# EasyEDA schematic SCH_555-pickaxe_2025-03-12.json
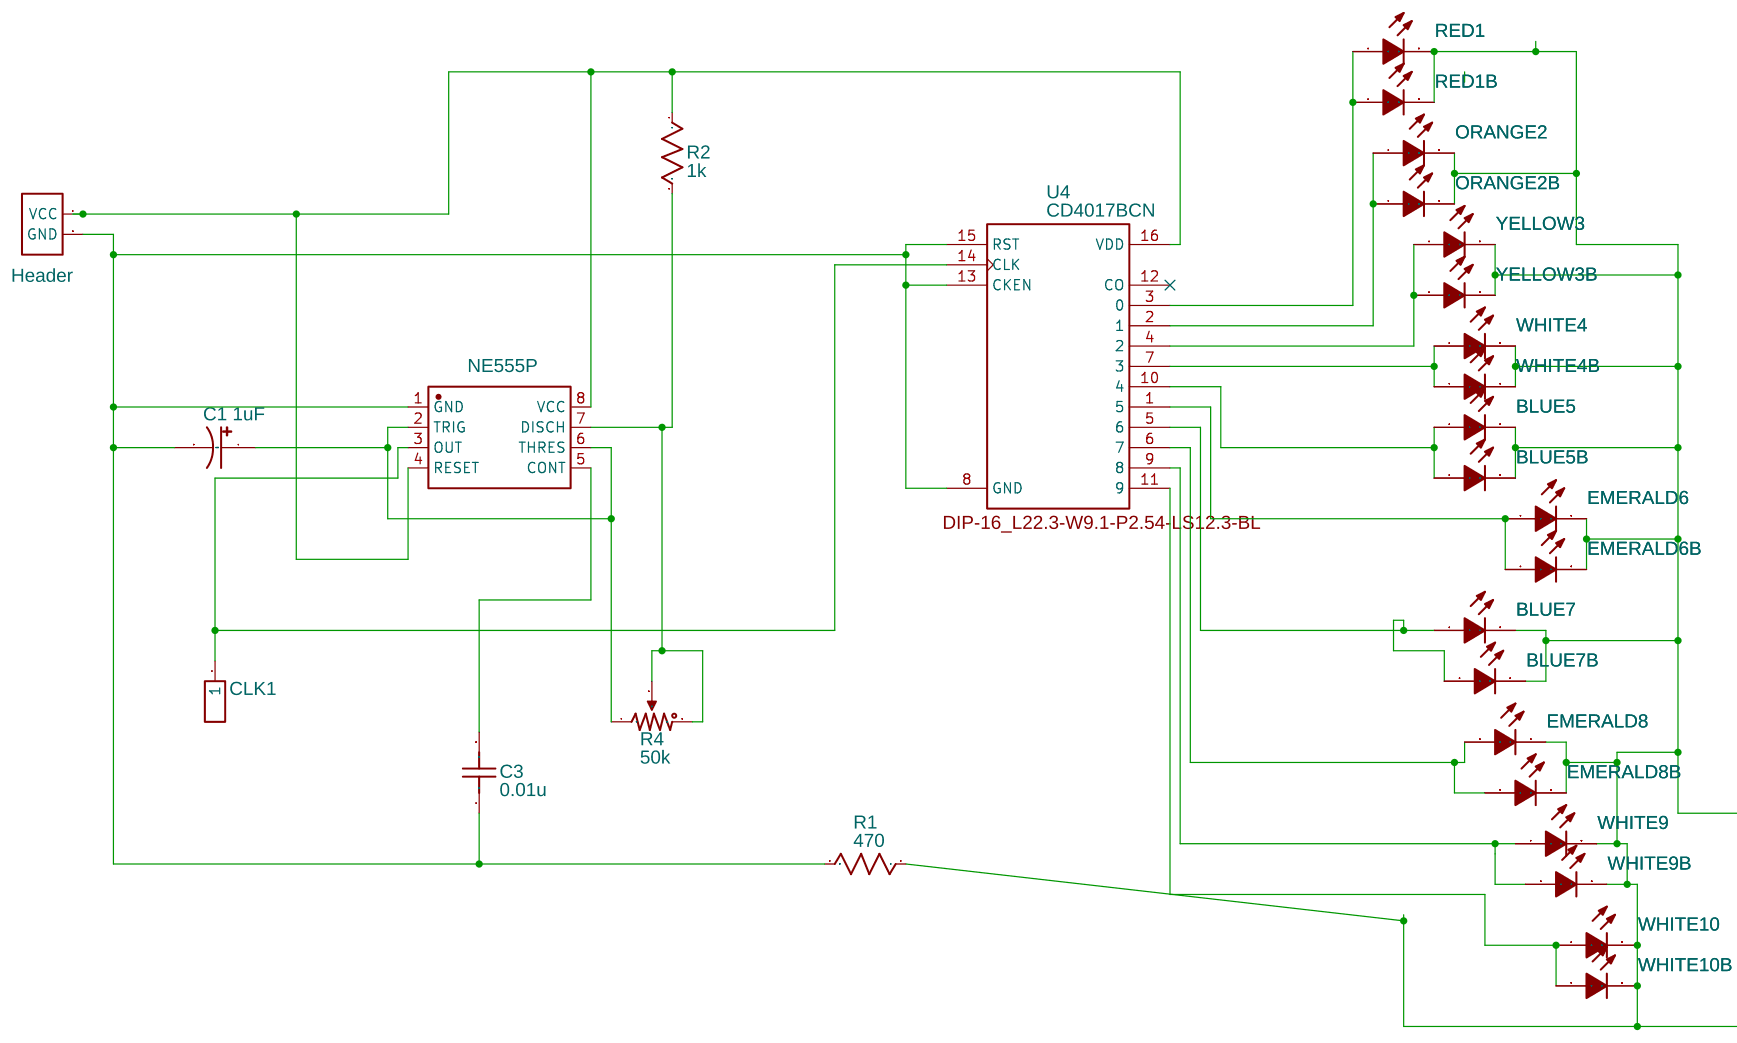
[diagram p0: schematic sheet]

## Parts
BLUE5  LED_5MM  [LED-TH_BD5.0-P2.54-FD_C9900023552]
BLUE5B  LED_5MM  [LED-TH_BD5.0-P2.54-FD_C9900023552]
BLUE7  LED_5MM  [LED-TH_BD5.0-P2.54-FD_C9900023552]
BLUE7B  LED_5MM  [LED-TH_BD5.0-P2.54-FD_C9900023552]
C1  C1 1uF  [CAP-TH_BD5.0-P2.00-D0.8-FD]
C3  0.01u  [C0603]
CLK1  C81276  [HDR-TH_1P-P2.54-V-M]
EMERALD6  LED_5MM  [LED-TH_BD5.0-P2.54-FD_C9900023552]
EMERALD6B  LED_5MM  [LED-TH_BD5.0-P2.54-FD_C9900023552]
EMERALD8  LED_5MM  [LED-TH_BD5.0-P2.54-FD_C9900023552]
EMERALD8B  LED_5MM  [LED-TH_BD5.0-P2.54-FD_C9900023552]
H1  Header  [HDR-M-2.54_1X2]
ORANGE2  LED_5MM  [LED-TH_BD5.0-P2.54-FD_C9900023552]
ORANGE2B  LED_5MM  [LED-TH_BD5.0-P2.54-FD_C9900023552]
R1  470  [R_AXIAL-0.3]
R2  1k  [R_AXIAL-0.3]
R4  50k  [RES-ADJ-3296X]
RED1  LED_5MM  [LED-TH_BD5.0-P2.54-FD_C9900023552]
RED1B  LED_5MM  [LED-TH_BD5.0-P2.54-FD_C9900023552]
U2  NE555P  [DIP-8_L9.8-W6.6-P2.54-LS7.6-BL]
U4  CD4017BCN  [DIP-16_L22.3-W9.1-P2.54-LS12.3-BL]
WHITE4  LED_5MM  [LED-TH_BD5.0-P2.54-FD_C9900023552]
WHITE4B  LED_5MM  [LED-TH_BD5.0-P2.54-FD_C9900023552]
WHITE9  LED_5MM  [LED-TH_BD5.0-P2.54-FD_C9900023552]
WHITE9B  LED_5MM  [LED-TH_BD5.0-P2.54-FD_C9900023552]
WHITE10  LED_5MM  [LED-TH_BD5.0-P2.54-FD_C9900023552]
WHITE10B  LED_5MM  [LED-TH_BD5.0-P2.54-FD_C9900023552]
YELLOW3  LED_5MM  [LED-TH_BD5.0-P2.54-FD_C9900023552]
YELLOW3B  LED_5MM  [LED-TH_BD5.0-P2.54-FD_C9900023552]

## Library data of the parts
BLUE5 BLUE5B BLUE7 BLUE7B = LED_5MM: Contributor: lcsc; Supplier: LCSC; Supplier Part: C559114
C1 = UVZ1H010MDD: Contributor: LCSC; Supplier: LCSC; Supplier Part: C62934; Manufacturer: Nichicon(尼吉康)
C3 = C_0603_US: Supplier Part: C136131; Supplier: LCSC; Contributor: LCEDA_Lib
CLK1 = Header-Male-2.54_1x1: Supplier: LCSC; Manufacturer Part: 2.54-1*1P针; JLCPCB Part Class: Extended Part; Package Display: No; Manufacturer: BOOMELE(Boom Precision Elec); Contributor: Thejo Prakash
EMERALD6 EMERALD6B EMERALD8 EMERALD8B = LED_5MM: Contributor: lcsc; Supplier: LCSC; Supplier Part: C2895483
H1 = HEADER-FEMALE-2.54_1X2: Contributor: nonstop2004; Supplier: LCSC; Supplier Part: C492401; Package Display: No
ORANGE2 ORANGE2B = LED_5MM: Contributor: lcsc; Supplier: LCSC; Supplier Part: C779445
R1 = Resistor: Manufacturer Part: ?; Supplier Part: C58592; Supplier: LCSC
R2 = Resistor: Manufacturer Part: ?; Supplier Part: C713997; Supplier: LCSC
R4 = Potentiometer: K(%): 50; Manufacturer Part: ?; Supplier: LCSC; Supplier Part: C118912; Package Display: No
RED1 RED1B = LED_5MM: Contributor: lcsc; Supplier: LCSC; Supplier Part: C2844743
U2 = NE555P: Supplier: LCSC; Manufacturer: TI(德州仪器); Supplier Part: C46749; JLCPCB Part Class: Extended Part
U4 = CD4017BCN: Decade CounterDivider with 10 Decoded Outputs; Supplier: LCSC; Supplier Part: C32710674; Package Display: Yes
WHITE4 WHITE4B WHITE9 WHITE9B WHITE10 WHITE10B = LED_5MM: Contributor: lcsc; Supplier: LCSC; Supplier Part: C2895480
YELLOW3 YELLOW3B = LED_5MM: Contributor: lcsc; Supplier: LCSC; Supplier Part: C330770

## Nets
Net-(BLUE5-1): BLUE5.1(A) BLUE5B.1(A) U4.10(4)
Net-(BLUE5-2): BLUE5.2(K) BLUE5B.2(K) BLUE7.2(K) BLUE7B.2(K) EMERALD6.2(K) EMERALD6B.2(K) EMERALD8.2(K) EMERALD8B.2(K) ORANGE2.2(K) ORANGE2B.2(K) R1.1 RED1.2(K) RED1B.2(K) WHITE4.2(K) WHITE4B.2(K) WHITE9.2(K) WHITE9B.2(K) WHITE10.2(K) WHITE10B.2(K) YELLOW3.2(K) YELLOW3B.2(K)
Net-(BLUE7-1): BLUE7.1(A) BLUE7B.1(A) U4.5(6)
Net-(C1-1): C1.1 R4.1 U2.2(TRIG) U2.6(THRES)
Net-(C1-2): C1.2 C3.1 H1.2(GND) R1.2 U2.1(GND) U4.8(GND) U4.13(CKEN) U4.15(RST)
Net-(C3-2): C3.2 U2.5(CONT)
Net-(CLK1-1): CLK1.1 U2.3(OUT) U4.14(CLK)
Net-(EMERALD6-1): EMERALD6.1(A) EMERALD6B.1(A) U4.1(5)
Net-(EMERALD8-1): EMERALD8.1(A) EMERALD8B.1(A) U4.6(7)
Net-(H1-1): H1.1(VCC) R2.1 U2.4(RESET) U2.8(VCC) U4.16(VDD)
Net-(ORANGE2-1): ORANGE2.1(A) ORANGE2B.1(A) U4.2(1)
Net-(R2-2): R2.2 R4.2(3) R4.3(2) U2.7(DISCH)
Net-(RED1-1): RED1.1(A) RED1B.1(A) U4.3(0)
Net-(U4-4): U4.4(2) YELLOW3.1(A) YELLOW3B.1(A)
Net-(U4-7): U4.7(3) WHITE4.1(A) WHITE4B.1(A)
Net-(U4-9): U4.9(8) WHITE9.1(A) WHITE9B.1(A)
Net-(U4-11): U4.11(9) WHITE10.1(A) WHITE10B.1(A)

Not connected (* = marked no-connect by the designer): U4 12(CO)*
